# EAGLE design galePCB (EAGLE 7.5.0)
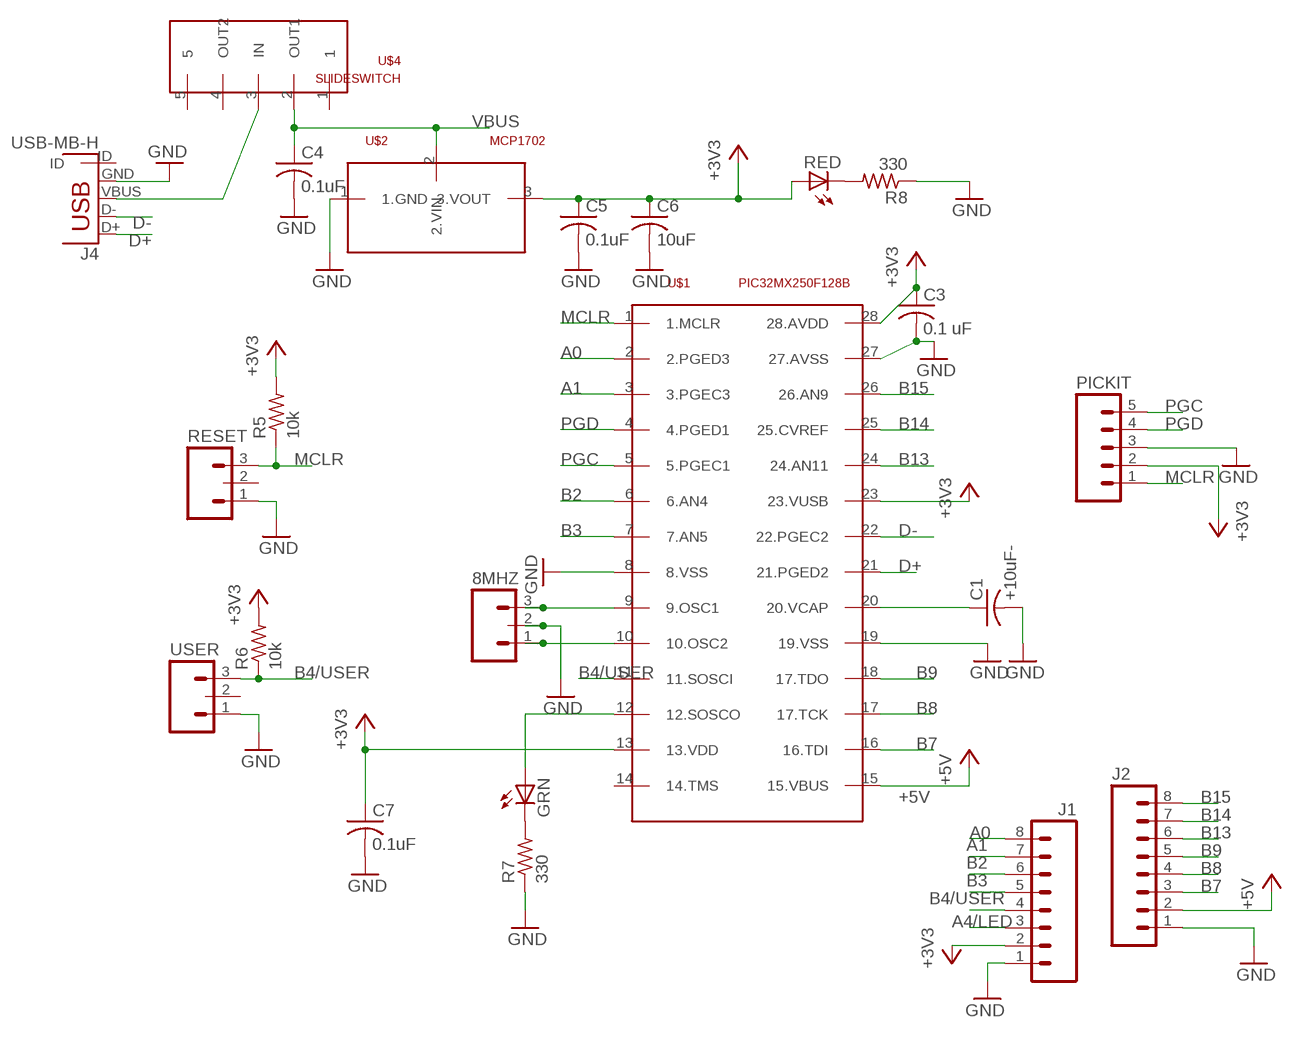
[diagram p0: schematic, sheet 1]

## Parts
8MHZ  M03PTH  [1X03]
C1  +10uF-  C-US025-024X044  [C025-024X044]
C3  0.1 uF  C-US025-024X044  [C025-024X044]
C4  0.1uF  C-US025-024X044  [C025-024X044]
C5  0.1uF  C-US025-024X044  [C025-024X044]
C6  10uF  C-US025-024X044  [C025-024X044]
C7  0.1uF  C-US025-024X044  [C025-024X044]
GRN  LED3MM  [LED3MM]
J1  M08  [1X08_ROUND]
J2  M08  [1X08_ROUND]
J4  USB-MB-H  [USB-MB-H]
PICKIT  M05PTH  [1X05]
R5  10k  R-US_0207/10  [0207/10]
R6  10k  R-US_0207/10  [0207/10]
R7  330  R-US_0207/10  [0207/10]
R8  330  R-US_0207/10  [0207/10]
RED  LED3MM  [LED3MM]
RESET  M03LOCK  [1X03_LOCK]
U$1  PIC32MX250F128B  PIC32  [DIL28-3]
U$2  MCP1702  [TO92]
U$4  SLIDESWITCH  [SLIDESWITCH]
USER  M03LOCK  [1X03_LOCK]

## Nets
+3V3: C3.1 C5.1 C6.1 C7.1 J1.2 PICKIT.2 R5.2 R6.2 RED.A U$1.13(13.VDD) U$1.23(23.VUSB) U$1.28(28.AVDD) U$2.3(3.VOUT)
+5V: J2.2 U$1.15(15.VBUS)
A0: J1.8 U$1.2(2.PGED3)
A1: J1.7 U$1.3(3.PGEC3)
A4/LED: GRN.A J1.3 U$1.12(12.SOSCO)
B2: J1.6 U$1.6(6.AN4)
B3: J1.5 U$1.7(7.AN5)
B4/USER: J1.4 R6.1 U$1.11(11.SOSCI) USER.3
B7: J2.3 U$1.16(16.TDI)
B8: J2.4 U$1.17(17.TCK)
B9: J2.5 U$1.18(17.TDO)
B13: J2.6 U$1.24(24.AN11)
B14: J2.7 U$1.25(25.CVREF)
B15: J2.8 U$1.26(26.AN9)
D+: J4.D+ U$1.21(21.PGED2)
D-: J4.D- U$1.22(22.PGEC2)
GND: 8MHZ.2 C1.2 C3.2 C4.2 C5.2 C6.2 C7.2 J1.1 J2.1 J4.GND PICKIT.3 R7.1 R8.1 RESET.1 U$1.8(8.VSS) U$1.19(19.VSS) U$1.27(27.AVSS) U$2.1(1.GND) USER.1
MCLR: PICKIT.1 R5.1 RESET.3 U$1.1(1.MCLR)
N$1: C1.1 U$1.20(20.VCAP)
N$2: 8MHZ.3 U$1.9(9.OSC1)
N$3: 8MHZ.1 U$1.10(10.OSC2)
N$5: R8.2 RED.K(C)
N$6: GRN.K(C) R7.2
PGC: PICKIT.5 U$1.5(5.PGEC1)
PGD: PICKIT.4 U$1.4(4.PGED1)
VBUS: C4.1 J4.VBUS U$2.2(2.VIN) U$4.2(OUT1) U$4.3(IN)
Unconnected: J4.ID RESET.2 U$1.14(14.TMS) U$4.1 U$4.4(OUT2) U$4.5 USER.2

## Library data of the parts
8MHZ RESET USER = myPCB:M03: Header 3 Standard 3-pin 0.1" header. Use with straight break away headers (SKU : PRT-00116), right angle break away headers (PRT-00553), swiss pins (PRT-00743), machine pins (PRT-00117), and female headers (PRT-00115). Molex polarized connector foot print use with SKU : PRT-08232 with associated crimp pins and housings.
C1 C3-C7 = myPCB:C-US: CAPACITOR, American symbol
GRN RED = myPCB:LED: LED OSRAM: - CHIPLED LG R971, LG N971, LY N971, LG Q971, LY Q971, LO R971, LY R971 LH N974, LH R974 LS Q976, LO Q976, LY Q976 LO Q996 - Hyper CHIPLED LW Q18S LB Q993, LB Q99A, LB R99A - SideLED LS A670, LO A670, LY A670, LG A670, LP A670 LB A673, LV A673, LT A673, LW A673 LH A674 LY A675 LS A676, LA A676, LO A676, LY A676, LW A676 LS A679, LY A679, LG A679 - Hyper Micro SIDELED® LS Y876, LA Y876, LO Y876, LY Y876 LT Y87S - SmartLED LW L88C, LW L88S LB L89C, LB L89S, LG L890 LS L89K, LO L89K, LY L89K LS L896, LA L896, LO L896, LY L896 - TOPLED LS T670, LO T670, LY T670, LG T670, LP T670 LSG T670, LSP T670, LSY T670, LOP T670, LYG T670 LG T671, LOG T671, LSG T671 LB T673, LV T673, LT T673, LW T673 LH T674 LS T676, LA T676, LO T676, LY T676, LB T676, LH T676, LSB T676, LW T676 LB T67C, LV T67C, LT T67C, LS T67K, LO T67K, LY T67K, LW E67C LS E67B, LA E67B, LO E67B, LY E67B, LB E67C, LV E67C, LT E67C LW T67C LS T679, LY T679, LG T679 LS T770, LO T770, LY T770, LG T770, LP T770 LB T773, LV T773, LT T773, LW T773 LH T774 LS E675, LA E675, LY E675, LS T675 LS T776, LA T776, LO T776, LY T776, LB T776 LHGB T686 LT T68C, LB T68C - Hyper Mini TOPLED® LB M676 - Mini TOPLED Santana® LG M470 LS M47K, LO M47K, LY M47K Source: http://www.osram.convergy.de LUXEON: - LUMILED® LXK2-PW12-R00, LXK2-PW12-S00, LXK2-PW14-U00, LXK2-PW14-V00 LXK2-PM12-R00, LXK2-PM12-S00, LXK2-PM14-U00 LXK2-PE12-Q00, LXK2-PE12-R00, LXK2-PE12-S00, LXK2-PE14-T00, LXK2-PE14-U00 LXK2-PB12-K00, LXK2-PB12-L00, LXK2-PB12-M00, LXK2-PB14-N00, LXK2-PB14-P00, LXK2-PB14-Q00 LXK2-PR12-L00, LXK2-PR12-M00, LXK2-PR14-Q00, LXK2-PR14-R00 LXK2-PD12-Q00, LXK2-PD12-R00, LXK2-PD12-S00 LXK2-PH12-R00, LXK2-PH12-S00 LXK2-PL12-P00, LXK2-PL12-Q00, LXK2-PL12-R00 Source: www.luxeon.com KINGBRIGHT: KA-3528ASYC Source: www.kingbright.com
J1 J2 = myPCB:M08: Header 8 Standard 8-pin 0.1" header. Use with straight break away headers (SKU : PRT-00116), right angle break away headers (PRT-00553), swiss pins (PRT-00743), machine pins (PRT-00117), and female headers (PRT-00115).; PROD_ID: CONN-08437
J4 = myPCB:USB: USB Connectors USB-B-PTH is fully proven SKU : PRT-00139/CONN-08278 USB-miniB is fully proven SKU : PRT-00587 USB-A-PCB is untested. USB-A-H is throughly reviewed, but untested. Spark Fun Electronics SKU : PRT-00437 USB-B-SMT is throughly reviewed, but untested. Needs silkscreen touching up. USB-A-S has not been used/tested USB-MB-H has not been used/tested USB-MICROB has been used. CONN-09505
PICKIT = myPCB:M05: Header 5 Standard 5-pin 0.1" header. Use with straight break away headers (SKU : PRT-00116), right angle break away headers (PRT-00553), swiss pins (PRT-00743), machine pins (PRT-00117), and female headers (PRT-00115). Molex polarized connector foot print use with SKU : PRT-08230 with associated crimp pins and housings.
R5-R8 = myPCB:R-US_: RESISTOR, American symbol
U$1 = myPCB:PIC32
U$2 = myPCB:MCP1702
U$4 = myPCB:SLIDESWITCH

## Board
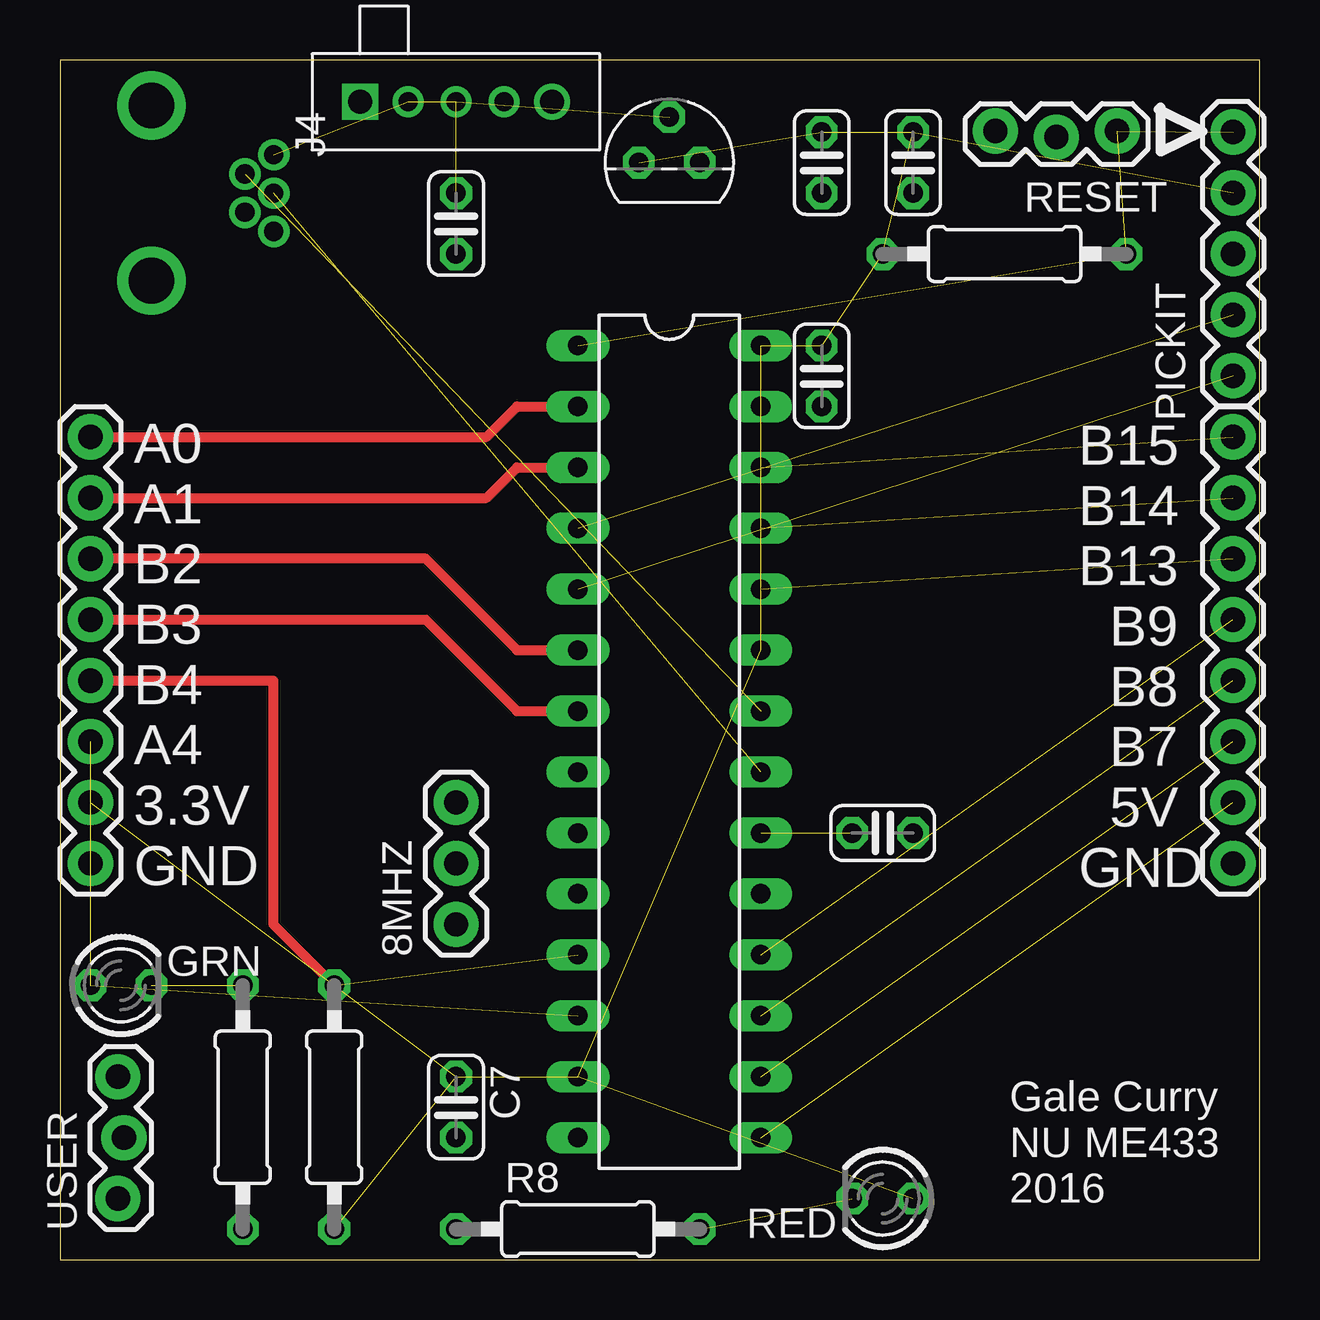
[diagram p1: board, top side]
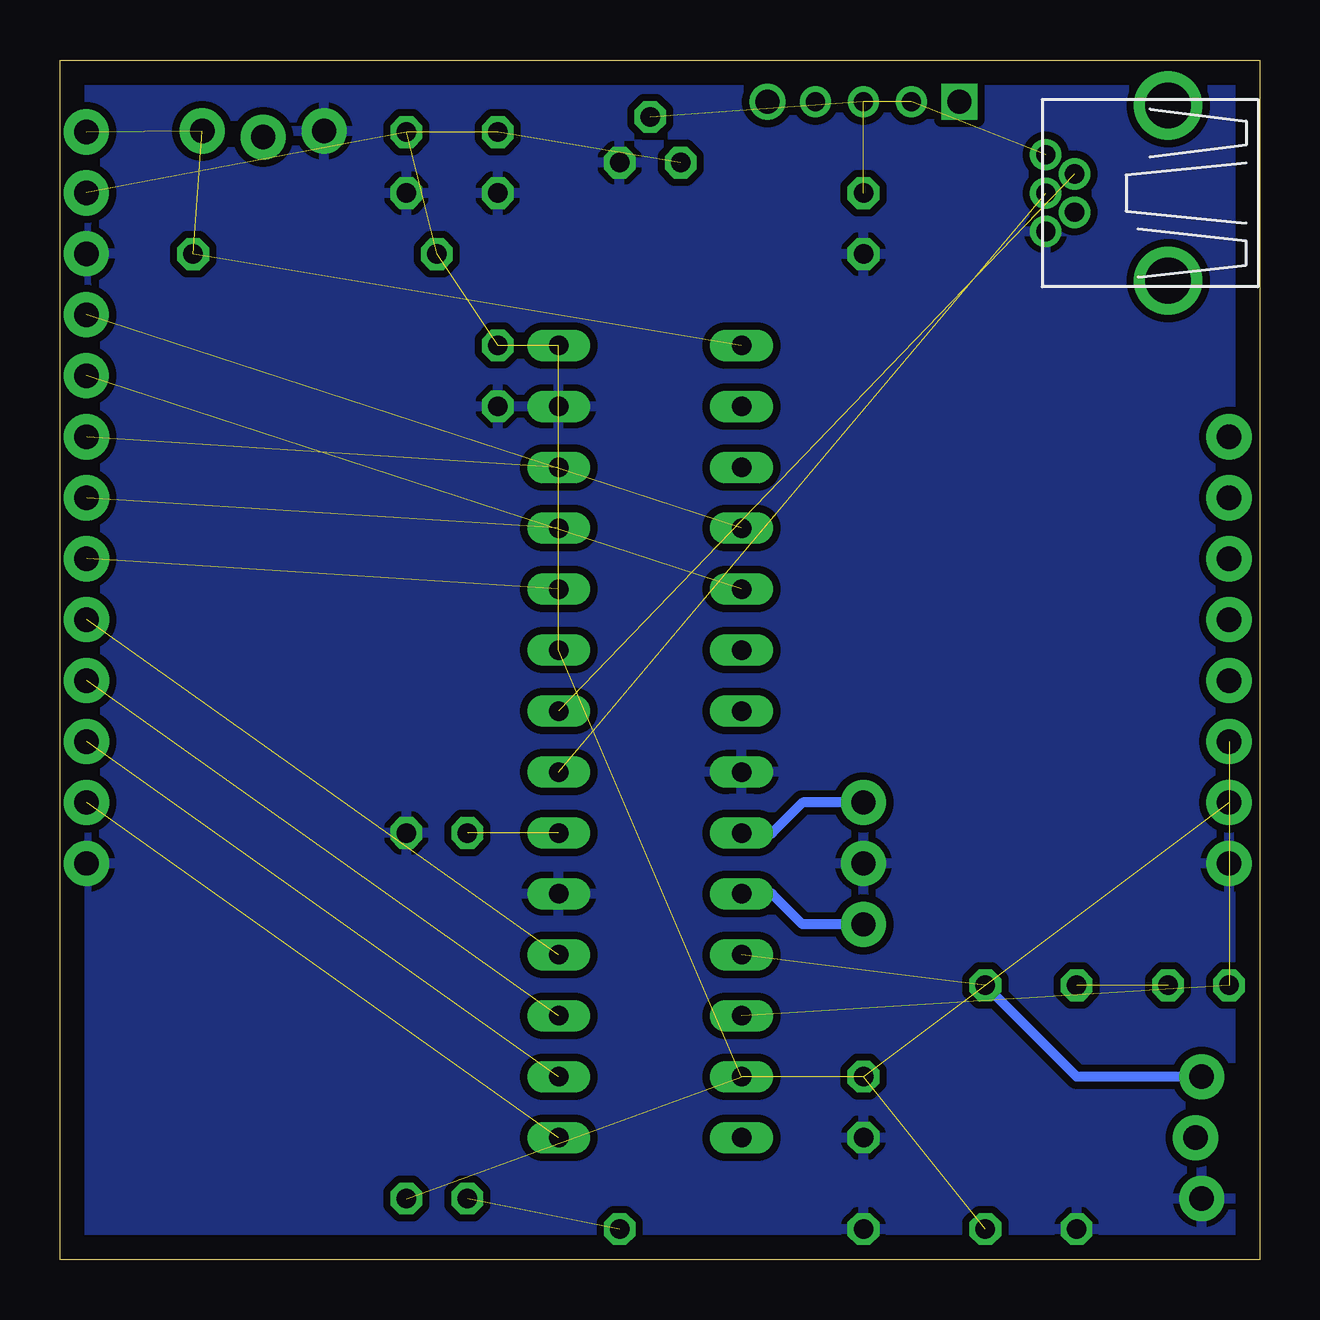
[diagram p2: board, bottom side, seen from below]

Size 50 x 50 mm. Coordinates in mm from the lower left corner, seen from the top.
Outline: 0,0 50,0 50,50 0,50 0,0
Copper layers (1*16): Top 0.035mm / dielectric 1.5mm / Bottom 0.035mm
Design rules "default": minimum track width 10mil, minimum drill 24mil, track to track 8mil, track to pad 8mil, pad to pad 8mil, via to via 8mil, smd to smd 8mil, copper to edge 40mil, drill to drill 8mil, minimum pad ring 10mil, minimum via ring 8mil, stop-mask expansion 4mil, vias tented up to drill 0mil, thermal gap 10mil

### Footprints (pad centres in the part's own frame; a part is rotated, then mirrored left to right if it is on the bottom)
1X03 = drill 1.016 pad 1.88: 1 0,0; 2 2.54,0; 3 5.08,0
C025-024X044 = drill 0.813 octagon: 1 -1.27,0; 2 1.27,0
LED3MM = drill 0.813 octagon: A -1.27,0; K 1.27,0
1X08_ROUND = drill 1.016 pad 1.88: 1 0,0; 2 2.54,0; 3 5.08,0; 4 7.62,0; 5 10.16,0; 6 12.7,0; 7 15.24,0; 8 17.78,0
USB-MB-H = drill 0.8: D+ 5.1,0; D- 3.9,0.8; GND 5.1,-1.6; ID 3.9,-0.8; VBUS 5.1,1.6 | drill 1.9: P$6 0,-3.65; P$7 0,3.65
1X05 = drill 1.016 pad 1.88: 1 0,0; 2 2.54,0; 3 5.08,0; 4 7.62,0; 5 10.16,0
0207/10 = drill 0.813 octagon: 1 -5.08,0; 2 5.08,0
1X03_LOCK = drill 1.016 pad 1.88: 1 0,0.127; 2 2.54,-0.127; 3 5.08,0.127
DIL28-3 = drill 0.813 long: 1 -16.51,-3.81; 2 -13.97,-3.81; 3 -11.43,-3.81; 4 -8.89,-3.81; 5 -6.35,-3.81; 6 -3.81,-3.81; 7 -1.27,-3.81; 8 1.27,-3.81; 9 3.81,-3.81; 10 6.35,-3.81; 11 8.89,-3.81; 12 11.43,-3.81; 13 13.97,-3.81; 14 16.51,-3.81; 15 16.51,3.81; 16 13.97,3.81; 17 11.43,3.81; 18 8.89,3.81; 19 6.35,3.81; 20 3.81,3.81; 21 1.27,3.81; 22 -1.27,3.81; 23 -3.81,3.81; 24 -6.35,3.81; 25 -8.89,3.81; 26 -11.43,3.81; 27 -13.97,3.81; 28 -16.51,3.81
TO92 = drill 0.813 octagon: 1 1.27,0; 2 0,1.905; 3 -1.27,0
SLIDESWITCH = drill 1 square: 1 -4,0 | drill 0.8: 2 -2,0; 3 0,0; 4 2,0 | drill 1: 5 4,0

### Placement (x,y rotation side)
8MHZ  16.51,13.97 90 top
C1  34.29,17.78 0 top
C3  31.75,36.83 270 top
C4  16.51,43.18 270 top
C5  35.56,45.72 270 top
C6  31.75,45.72 270 top
C7  16.51,6.35 270 top
GRN  2.54,11.43 0 top
J1  1.27,16.51 90 top
J2  48.9,16.51 90 top
J4  3.81,44.45 0 top
PICKIT  48.9,47 270 top
R5  39.37,41.91 180 top
R6  11.43,6.35 270 top
R7  7.62,6.35 90 top
R8  21.59,1.27 0 top
RED  34.29,2.54 180 top
RESET  38.99,46.91 0 top
U$1  25.4,21.59 270 top
U$2  25.4,45.72 0 top
U$4  16.51,48.26 0 top
USER  2.54,2.54 90 top

### Tracks (layer width: path | path; a pad name or v marks a point on that pad's centre or on a via)
+3V3  (12 unrouted)
+5V  (1 unrouted)
A0
  Top 0.406: J1.8 17.78,34.29 19.05,35.56 U$1.2
A1
  Top 0.406: J1.7 17.78,31.75 19.05,33.02 U$1.3
A4/LED  (2 unrouted)
B2
  Top 0.406: U$1.6 19.05,25.4 15.24,29.21 J1.6
B3
  Top 0.406: J1.5 15.24,26.67 19.05,22.86 U$1.7
B4/USER  (1 unrouted)
  Top 0.406: J1.4 8.89,24.13 8.89,13.97 R6.1
  Bottom 0.406: USER.3 7.62,7.62 R6.1
B7  (1 unrouted)
B8  (1 unrouted)
B9  (1 unrouted)
B13  (1 unrouted)
B14  (1 unrouted)
B15  (1 unrouted)
D+  (1 unrouted)
D-  (1 unrouted)
GND
  pour Bottom (isolate 0.305): 0,49.53 0,0 49.53,0 49.53,49.53
MCLR  (3 unrouted)
N$1  (1 unrouted)
N$2
  Bottom 0.406: 8MHZ.3 19.05,19.05 20.32,17.78 U$1.9
N$3
  Bottom 0.406: 8MHZ.1 19.05,13.97 20.32,15.24 U$1.10
N$5  (1 unrouted)
N$6  (1 unrouted)
PGC  (1 unrouted)
PGD  (1 unrouted)
VBUS  (4 unrouted)

### Text on the board
tPlace: A0 / A1 / B2 / B3 / B4 / A4 / 3.3V / GND | B15 / B14 / B13 / B9 / B8 / B7 / 5V / GND | Gale Curry / NU ME433 / 2016